# EasyEDA Pro project 模块化香薰灯电路原理图-初步dev001（嘉立创专业版）.epro

# Schematic 主板原理图
Board Name: 主板; Create Date: 2024-08-11; Page Name: P1; Project Name: 香薰灯0811; Schematic Name: 主板原理图; Update Date: 2024-08-12; Company: 嘉立创EDA; Page Size: A4; Version: V1.0
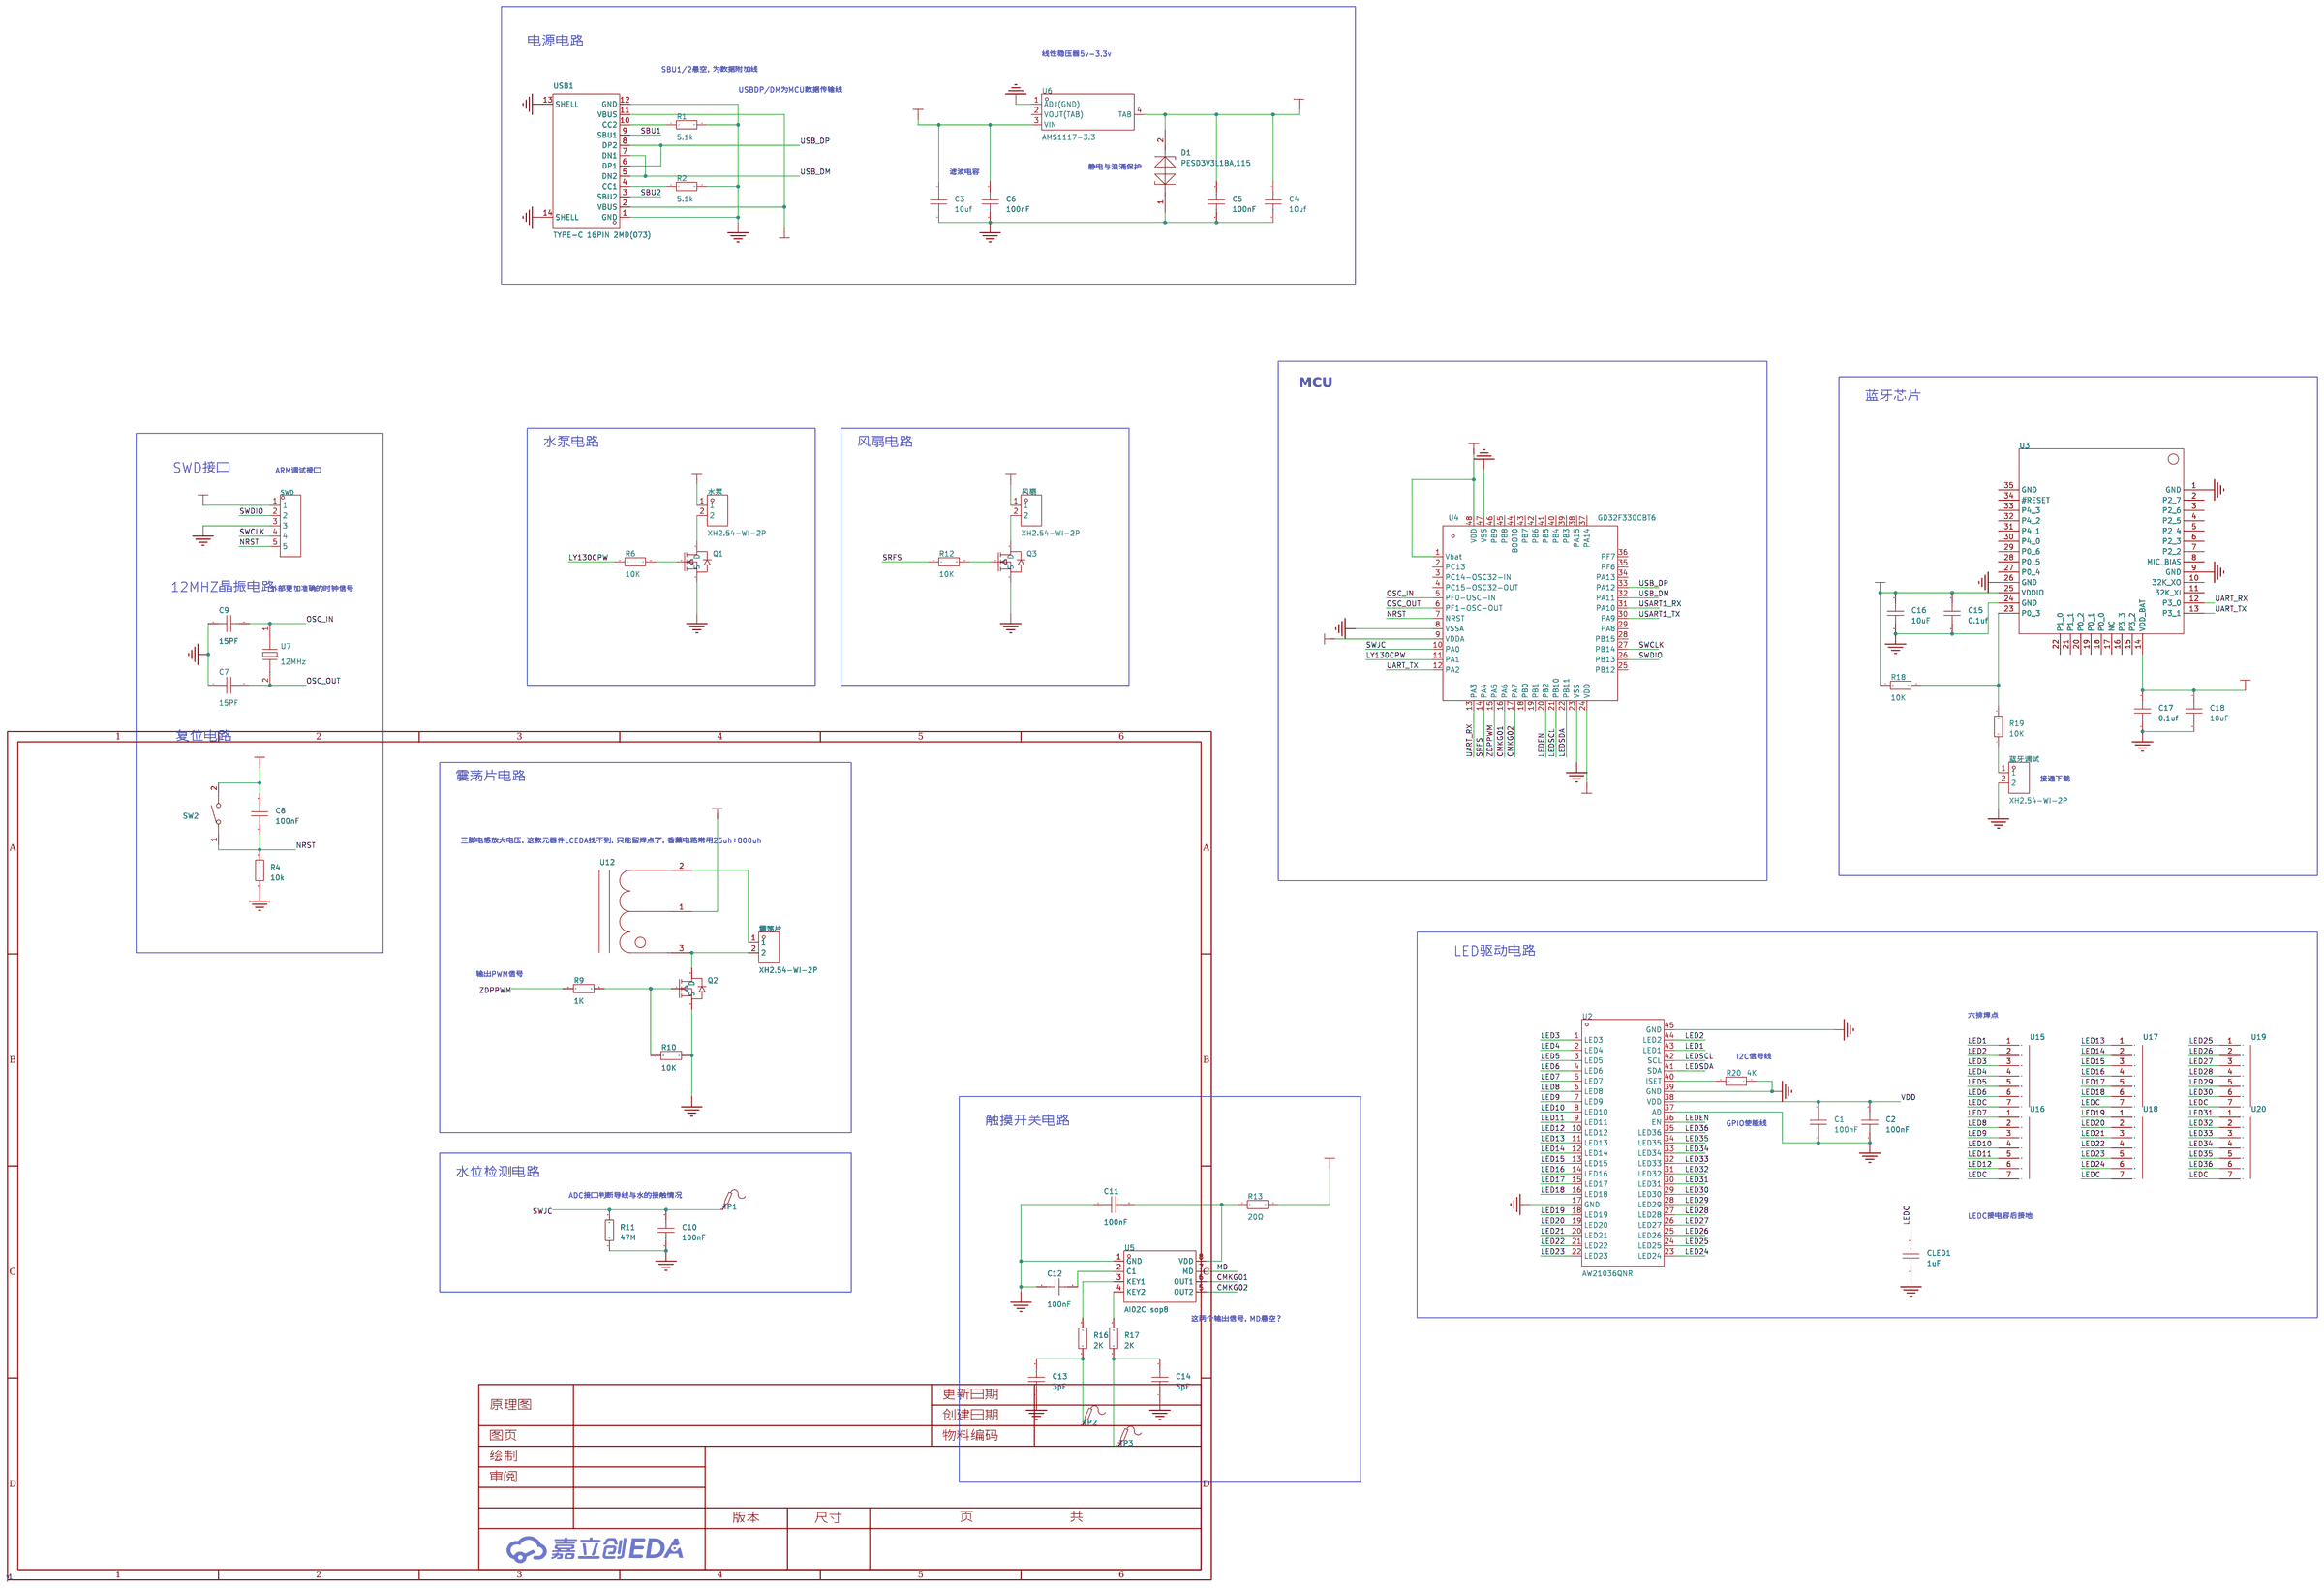
[diagram p0: schematic sheet]

## Parts
C1  100nF  [C0805]
C2  100nF  [C0805]
C3  10uf  [C0805]
C4  10uf  [C0805]
C5  100nF  [C0805]
C6  100nF  [C0805]
C7  15PF  [C0805]
C8  100nF  [C0805]
C9  15PF  [C0805]
C10  100nF  [C0805]
C11  100nF  [C0805]
C12  100nF  [C0805]
C13  3pF  [C0805]
C14  3pF  [C0805]
C15  0.1uf  [C0805]
C16  10uF  [C0805]
C17  0.1uf  [C0805]
C18  10uF  [C0805]
CLED1  1uF  [C0805]
D1  PESD3V3L1BA,115  [SOD-323_L1.8-W1.3-LS2.5-BI]
Q1  -  [SOT-23-3_L2.9-W1.3-P1.90-LS2.4-BR]
Q2  -  [SOT-23-3_L2.9-W1.3-P1.90-LS2.4-BR]
Q3  -  [SOT-23-3_L2.9-W1.3-P1.90-LS2.4-BR]
R1  5.1k  [R0805]
R2  5.1k  [R0805]
R4  10k  [R0805]
R6  10K  [R0805]
R9  1K  [R0805]
R10  10K  [R0805]
R11  47M  [R0805]
R12  10K  [R0805]
R13  20Ω  [R0805]
R16  2K  [R0805]
R17  2K  [R0805]
R18  10K  [R0805]
R19  10K  [R0805]
R20  4K  [R0805]
SW2  轻触按键3*4*H  [SW-SMD_L4.0-W2.9-LS5.0]
SWD  -  [HDR-TH_5P-P2.54-V-M]
TP1  -  [Test-Point-0.5mm]
TP2  -  [Test-Point-0.5mm]
TP3  -  [Test-Point-0.5mm]
U2  AW21036QNR  [QFN-44_L5.0-W5.0-P0.40-TL-EP2.5]
U3  -  [MHCB12G-IB]
U4  GD32F330CBT6  [LQFP-48_L7.0-W7.0-P0.50-LS9.0-BL]
U5  AI02C sop8  [SOP-8_L4.9-W3.9-P1.27-LS6.0-BL]
U6  AMS1117-3.3  [SOT-223-4_L6.5-W3.5-P2.30-LS7.0-BR]
U7  12MHz  [HC-49S_L11.0-W4.7-LS4.88]
U12  -  [CD75/CD0805]
U15  -  [12handian]
U16  -  [12handian]
U17  -  [12handian]
U18  -  [12handian]
U19  -  [12handian]
U20  -  [12handian]
USB1  TYPE-C 16PIN 2MD(073)  [USB-C-SMD_TYPE-C-6PIN-2MD-073]
水泵  XH2.54-WI-2P  [CONN-TH_XH2.54-WI-2P]
蓝牙调试  XH2.54-WI-2P  [CONN-TH_XH2.54-WI-2P]
震荡片  XH2.54-WI-2P  [CONN-TH_XH2.54-WI-2P]
风扇  XH2.54-WI-2P  [CONN-TH_XH2.54-WI-2P]

## Library data of the parts
C1-C18 CLED1 = CAP_0805: Supplier Footprint: 0805
D1 = PESD3V3L1BA,115: 极性:双向;反向截止电压(Vrwm):3.3V;最大钳位电压:26V;峰值脉冲电流(Ipp)@10/1000us:18A;峰值脉冲功率(Ppp)@10/1000us:500W;击穿电压:5.8V;; LCSC Part Name: 双向ESD; Supplier Part: C51450; Manufacturer: Nexperia(安世); Supplier Footprint: SOD-323; JLCPCB Part Class: 扩展库; Datasheet: https://atta.szlcsc.com/upload/public/pdf/source/20150618/1457707322983.pdf; Supplier: LCSC; polarity: 双向; Reverse Stand-Off Voltage (Vrwm): 3.3V; Maximum Clamping Voltage: 26V; Peak Pulse Current (Ipp)@10/1000us: 18A; Peak Pulse Power Dissipation (Ppp)@10/1000us: 500W; Breakdown Voltage: 5.8V; Operating Temperature: -65℃~+150℃@(Ta); Type: ESD
Q1-Q3 = AO3400A_N: 类型:N沟道;漏源电压(Vdss):30V;连续漏极电流(Id):5.2A;功率(Pd):1W;导通电阻(RDS(on)@Vgs,Id):35mΩ@10V,5A;阈值电压(Vgs(th)@Id):1.5V@250μA;; Supplier Footprint: SOT-23; Supplier Part: C700953
R1 R2 R4 R6 R9-R13 R16-R20 = Res_0805: Supplier Footprint: 0805
SW2 = 轻触按键3*4*H: Supplier Part: C9900017573; Supplier Footprint: 轻触按键3*4*2.5; Supplier: LCSC
SWD = HDR-M_2.54_1x5P: Supplier Part: C358687; Supplier Footprint: 插件
TP1-TP3 = Test-Point: Test Point 测试点
U2 = AW21036QNR: Supplier Part: C5125743; Manufacturer: AWINIC(艾为); Supplier Footprint: QFN-44-EP(5x5); JLCPCB Part Class: 扩展库; Datasheet: https://atta.szlcsc.com/upload/public/pdf/source/20220913/6ED7A783A0635C15F3BB01B459993D88.pdf; Supplier: LCSC
U3 = MHCB12G-B: 小米蓝牙芯片
U4 = GD32F330CBT6: CPU内核:CM4;程序存储容量:64KB;RAM总容量:16KB;GPIO端口数量:39;工作电压范围:2.6V~3.6V;CPU最大主频:84MHz;程序存储器类型:FLASH;; Supplier Part: C139946; Manufacturer: GigaDevice(兆易创新); Supplier Footprint: LQFP-48(7x7); JLCPCB Part Class: 扩展库; Datasheet: https://atta.szlcsc.com/upload/public/pdf/source/20180227/C182133_15196977406091370141.pdf; Supplier: LCSC; CPU Core: CM4; Program Storage Size: 64KB; RAM Size: 16KB; GPIO Ports Number: 39; Operating Voltage Range: 2.6V~3.6V; CPU Maximum Speed: 84MHz; Program Memory Type: FLASH; Operating Temperature Range: -40℃~+85℃; ADC (Bit): 12bit; PWM (Bit): 16bit; 16Bit Timer: 5; 32Bit Timer: 1; UART/USART: 2; I2C: 2; SPI: 2; Peripheral/Function: 片载温度传感器；DMA；看门狗；LIN总线协议；PWM；除法器；IrDA；乘法器；RTC实时时钟; Watchdog: 有; Real-Time Clock: 有; Infrared Data Association: 有; Direct Memory Access: 有; Internal Oscillator: 有
U5 = AI02C sop8: 通道数:2;; LCSC Part Name: 2通道触摸芯片; Supplier Part: C2943976; Manufacturer: Sam&wing(芯网); Supplier Footprint: SOP-8; JLCPCB Part Class: 扩展库; Datasheet: https://atta.szlcsc.com/upload/public/pdf/source/20220117/73357AC887120FD4586041BC17440E55.pdf; Supplier: LCSC; The Channel Number: 2
U6 = AMS1117-3.3_C347222: 输出类型:固定;最大输入电压:12V;输出电压:3.3V;最大输出电流:1A;电源纹波抑制比(PSRR):60dB@(120Hz);输出极性:正极;; LCSC Part Name: 输出:3.3V 电流:1A 耐压:12V; Supplier Part: C347222; Manufacturer: UMW(友台半导体); Supplier Footprint: SOT-223; JLCPCB Part Class: 扩展库; Datasheet: https://atta.szlcsc.com/upload/public/pdf/source/20231109/155D79A26D9DB04352555A58D5969DC8.pdf; Supplier: LCSC; Output Type: 固定; Maximum Input Voltage: 12V; Output Voltage: 3.3V; MAX Output Current: 1A; Power Supply Rejection Ratio (PSRR): 60dB@(120Hz); Dropout Voltage: 1.3V@(1A); Output Polarity: 正极; Number of Outputs: 1
U7 = 9AC12000123060C3: 晶振类型:直插晶振;频率:12MHz;常温频差:±30ppm;外接负载电容:12pF;; LCSC Part Name: 12MHz ±30ppm 12pF; Supplier Part: C2715912; Manufacturer: JGHC(晶光华); Supplier Footprint: HC-49S; JLCPCB Part Class: 扩展库; Datasheet: https://atta.szlcsc.com/upload/public/pdf/source/20210330/C2715912_C1248AC65A6D6A629B561008BE58AE5C.pdf; Supplier: LCSC; Crystal Type: 直插晶振; Normal temperature Frequency Tolerance: ±30ppm; External load capacitor: 12pF; Equivalent Series Resistance (ESR): 60Ω; Operating Temperature: -40℃~+85℃
U12 = CD75/CD0805
U15-U20 = 12handian
USB1 = TYPE-C 16PIN 2MD(073): 连接器类型:Type-C;标准:-;公母:母;端口数量:1;触点数量:16P;安装方式:卧贴;额定电流 - 电源:5A;工作温度范围:-25℃~+85℃;; LCSC Part Name: Type-C 母 卧贴; Supplier Part: C2765186; Manufacturer: SHOU HAN(首韩); Supplier Footprint: SMD; JLCPCB Part Class: 扩展库; Datasheet: https://atta.szlcsc.com/upload/public/pdf/source/20211123/39B17C16241EAC15C5E277BDA434118E.pdf; Supplier: LCSC; Connector Type: Type-C; Gender: 母; Number of Ports: 1; Number of Contacts: 16P; Mounting Style: 卧贴; Current Rating - Power (Max): 5A; Operating Temperature Range: -25℃~+85℃
水泵 蓝牙调试 震荡片 风扇 = XH2.54-WI-2P: Supplier Part: C9900005527; Supplier Footprint: XH2.54MM-2P; JLCPCB Part Class: 扩展库; Supplier: LCSC

## Nets
3.3V: C4.1 C5.1 C8.2 C15.1 C16.1 C17.1 C18.1 D1.2 R13.2 R18.1 SW2.2 SWD.1 U3.14(VDD_BAT) U3.25(VDDIO) U4.1(Vbat) U4.9(VDDA) U4.24(VDD) U4.48(VDD) U6.4(TAB) 水泵.1 风扇.1
GND: C1.1 C2.1 C3.2 C4.2 C5.2 C6.2 C7.1 C9.1 C10.2 C11.1 C12.1 C13.1 C14.1 C15.2 C16.2 C17.2 C18.2 CLED1.1 D1.1 Q1.2(S) Q2.2(S) Q3.2(S) R1.2 R2.2 R4.1 R10.2 R11.1 R20.1 SWD.3 U2.17(GND) U2.37(AD) U2.39(GND) U2.45(GND) U3.1(GND) U3.9(GND) U3.24(GND) U3.26(GND) U4.8(VSSA) U4.23(VSS) U4.47(VSS) U5.1(GND) U6.1(ADJ(GND)) USB1.1(GND) USB1.12(GND) USB1.13(SHELL) USB1.14(SHELL) 蓝牙调试.2
VDD: C1.2 C2.2 U2.38(VDD)
VIN: C3.1 C6.1 U6.3(VIN) U12.1 USB1.2(VBUS) USB1.11(VBUS)
CMKG01: U4.16(PA6) U5.6(OUT1)
CMKG02: U4.17(PA7) U5.5(OUT2)
LED1: U2.43(LED1) U15.1
LED2: U2.44(LED2) U15.2
LED3: U2.1(LED3) U15.3
LED4: U2.2(LED4) U15.4
LED5: U2.3(LED5) U15.5
LED6: U2.4(LED6) U15.6
LED7: U2.5(LED7) U16.1
LED8: U2.6(LED8) U16.2
LED9: U2.7(LED9) U16.3
LED10: U2.8(LED10) U16.4
LED11: U2.9(LED11) U16.5
LED12: U2.10(LED12) U16.6
LED13: U2.11(LED13) U17.1
LED14: U2.12(LED14) U17.2
LED15: U2.13(LED15) U17.3
LED16: U2.14(LED16) U17.4
LED17: U2.15(LED17) U17.5
LED18: U2.16(LED18) U17.6
LED19: U2.18(LED19) U18.1
LED20: U2.19(LED20) U18.2
LED21: U2.20(LED21) U18.3
LED22: U2.21(LED22) U18.4
LED23: U2.22(LED23) U18.5
LED24: U2.23(LED24) U18.6
LED25: U2.24(LED25) U19.1
LED26: U2.25(LED26) U19.2
LED27: U2.26(LED27) U19.3
LED28: U2.27(LED28) U19.4
LED29: U2.28(LED29) U19.5
LED30: U2.29(LED30) U19.6
LED31: U2.30(LED31) U20.1
LED32: U2.31(LED32) U20.2
LED33: U2.32(LED33) U20.3
LED34: U2.33(LED34) U20.4
LED35: U2.34(LED35) U20.5
LED36: U2.35(LED36) U20.6
LEDC: CLED1.2 U15.7 U16.7 U17.7 U18.7 U19.7 U20.7
LEDEN: U2.36(EN) U4.20(PB2)
LEDSCL: U2.42(SCL) U4.21(PB10)
LEDSDA: U2.41(SDA) U4.22(PB11)
LY130CPW: R6.1 U4.11(PA1)
MD: U5.7(MD)
NRST: C8.1 R4.2 SW2.1 SWD.5 U4.7(NRST)
OSC_IN: C9.2 U4.5(PF0-OSC-IN) U7.1
OSC_OUT: C7.2 U4.6(PF1-OSC-OUT) U7.2(GND)
SBU1: USB1.9(SBU1)
SBU2: USB1.3(SBU2)
SRFS: R12.1 U4.14(PA4)
SWCLK: SWD.4 U4.27(PB14)
SWDIO: SWD.2 U4.26(PB13)
SWJC: C10.1 R11.2 TP1.1 U4.10(PA0)
UART_RX: U3.12(P3_0) U4.13(PA3)
UART_TX: U3.13(P3_1) U4.12(PA2)
USART1_RX: U4.31(PA10)
USART1_TX: U4.30(PA9)
USB_DM: U4.32(PA11) USB1.5(DN2) USB1.7(DN1)
USB_DP: U4.33(PA12) USB1.6(DP1) USB1.8(DP2)
ZDPPWM: R9.1 U4.15(PA5)
$1N5125: R1.1 USB1.10(CC2)
$1N5189: R2.1 USB1.4(CC1)
$1N6579: Q1.3(D) 水泵.2
$1N6600: Q1.1(G) R6.2
$1N7931: Q2.1(G) R9.2 R10.1
$1N8080: Q2.3(D) U12.3 震荡片.2
$1N8094: U12.2 震荡片.1
$1N8507: Q3.1(G) R12.2
$1N8508: Q3.3(D) 风扇.2
$1N8591: C11.2 R13.1 U5.8(VDD)
$1N8758: C12.2 U5.2(C1)
$1N8776: R16.2 U5.3(KEY1)
$1N8784: R17.2 U5.4(KEY2)
$1N8987: C14.2 R17.1 TP3.1
$1N8992: C13.2 R16.1 TP2.1
$1N9527: R19.1 蓝牙调试.1
$1N9532: R18.2 R19.2 U3.23(P0_3)
$1N9686: R20.2 U2.40(ISET)

Not connected (* = marked no-connect by the designer): U3 2(P2_7) 3(P2_6) 4(P2_5) 5(P2_4) 6(P2_3) 7(P2_2) 8(MIC_BIAS) 10(32K_XO) 11(32K_XI) 15(P3_2) 16(P3_3) 17(NC) 18(P0_0) 19(P0_1) 20(P0_2) 21(P1_1) 22(P1_0) 27(P0_4) 28(P0_5) 29(P0_6) 30(P4_0) 31(P4_1) 32(P4_2) 33(P4_3) 34(#RESET) 35(GND); U4 2(PC13) 3(PC14-OSC32-IN) 4(PC15-OSC32-OUT) 18(PB0) 19(PB1) 25(PB12) 28(PB15) 29(PA8) 34(PA13) 35(PF6) 36(PF7) 37(PA14) 38(PA15) 39(PB3) 40(PB4) 41(PB5) 42(PB6) 43(PB7) 44(BOOT0) 45(PB8) 46(PB9); U6 2(VOUT(TAB))

## Notes on the sheet
- 电源电路
- 线性稳压器5v-3.3v
- SBU1/2悬空，为数据附加线
- USBDP/DM为MCU数据传输线
- 滤波电容
- 静电与浪涌保护
- MCU
- 蓝牙芯片
- 水泵电路
- 风扇电路
- SWD接口
- ARM调试接口
- 12MHZ晶振电路
- 外部更加准确的时钟信号
- 复位电路
- 震荡片电路
- 接通下载
- 三脚电感放大电压，这款元器件LCEDA找不到，只能留焊点了，香薰电路常用25uh：800uh
- LED驱动电路
- 输出PWM信号
- 六排焊点
- I2C信号线
- 触摸开关电路
- GPIO使能线
- 水位检测电路
- ADC接口判断导线与水的接触情况
- LEDC接电容后接地
- 这两个输出信号，MD悬空？

# Schematic 灯板原理图
Board Name: 灯板; Create Date: 2024-08-11; Page Name: P1; Project Name: 香薰灯0811; Schematic Name: 灯板原理图; Update Date: 2024-08-12; Company: 嘉立创EDA; Page Size: A4; Version: V1.0
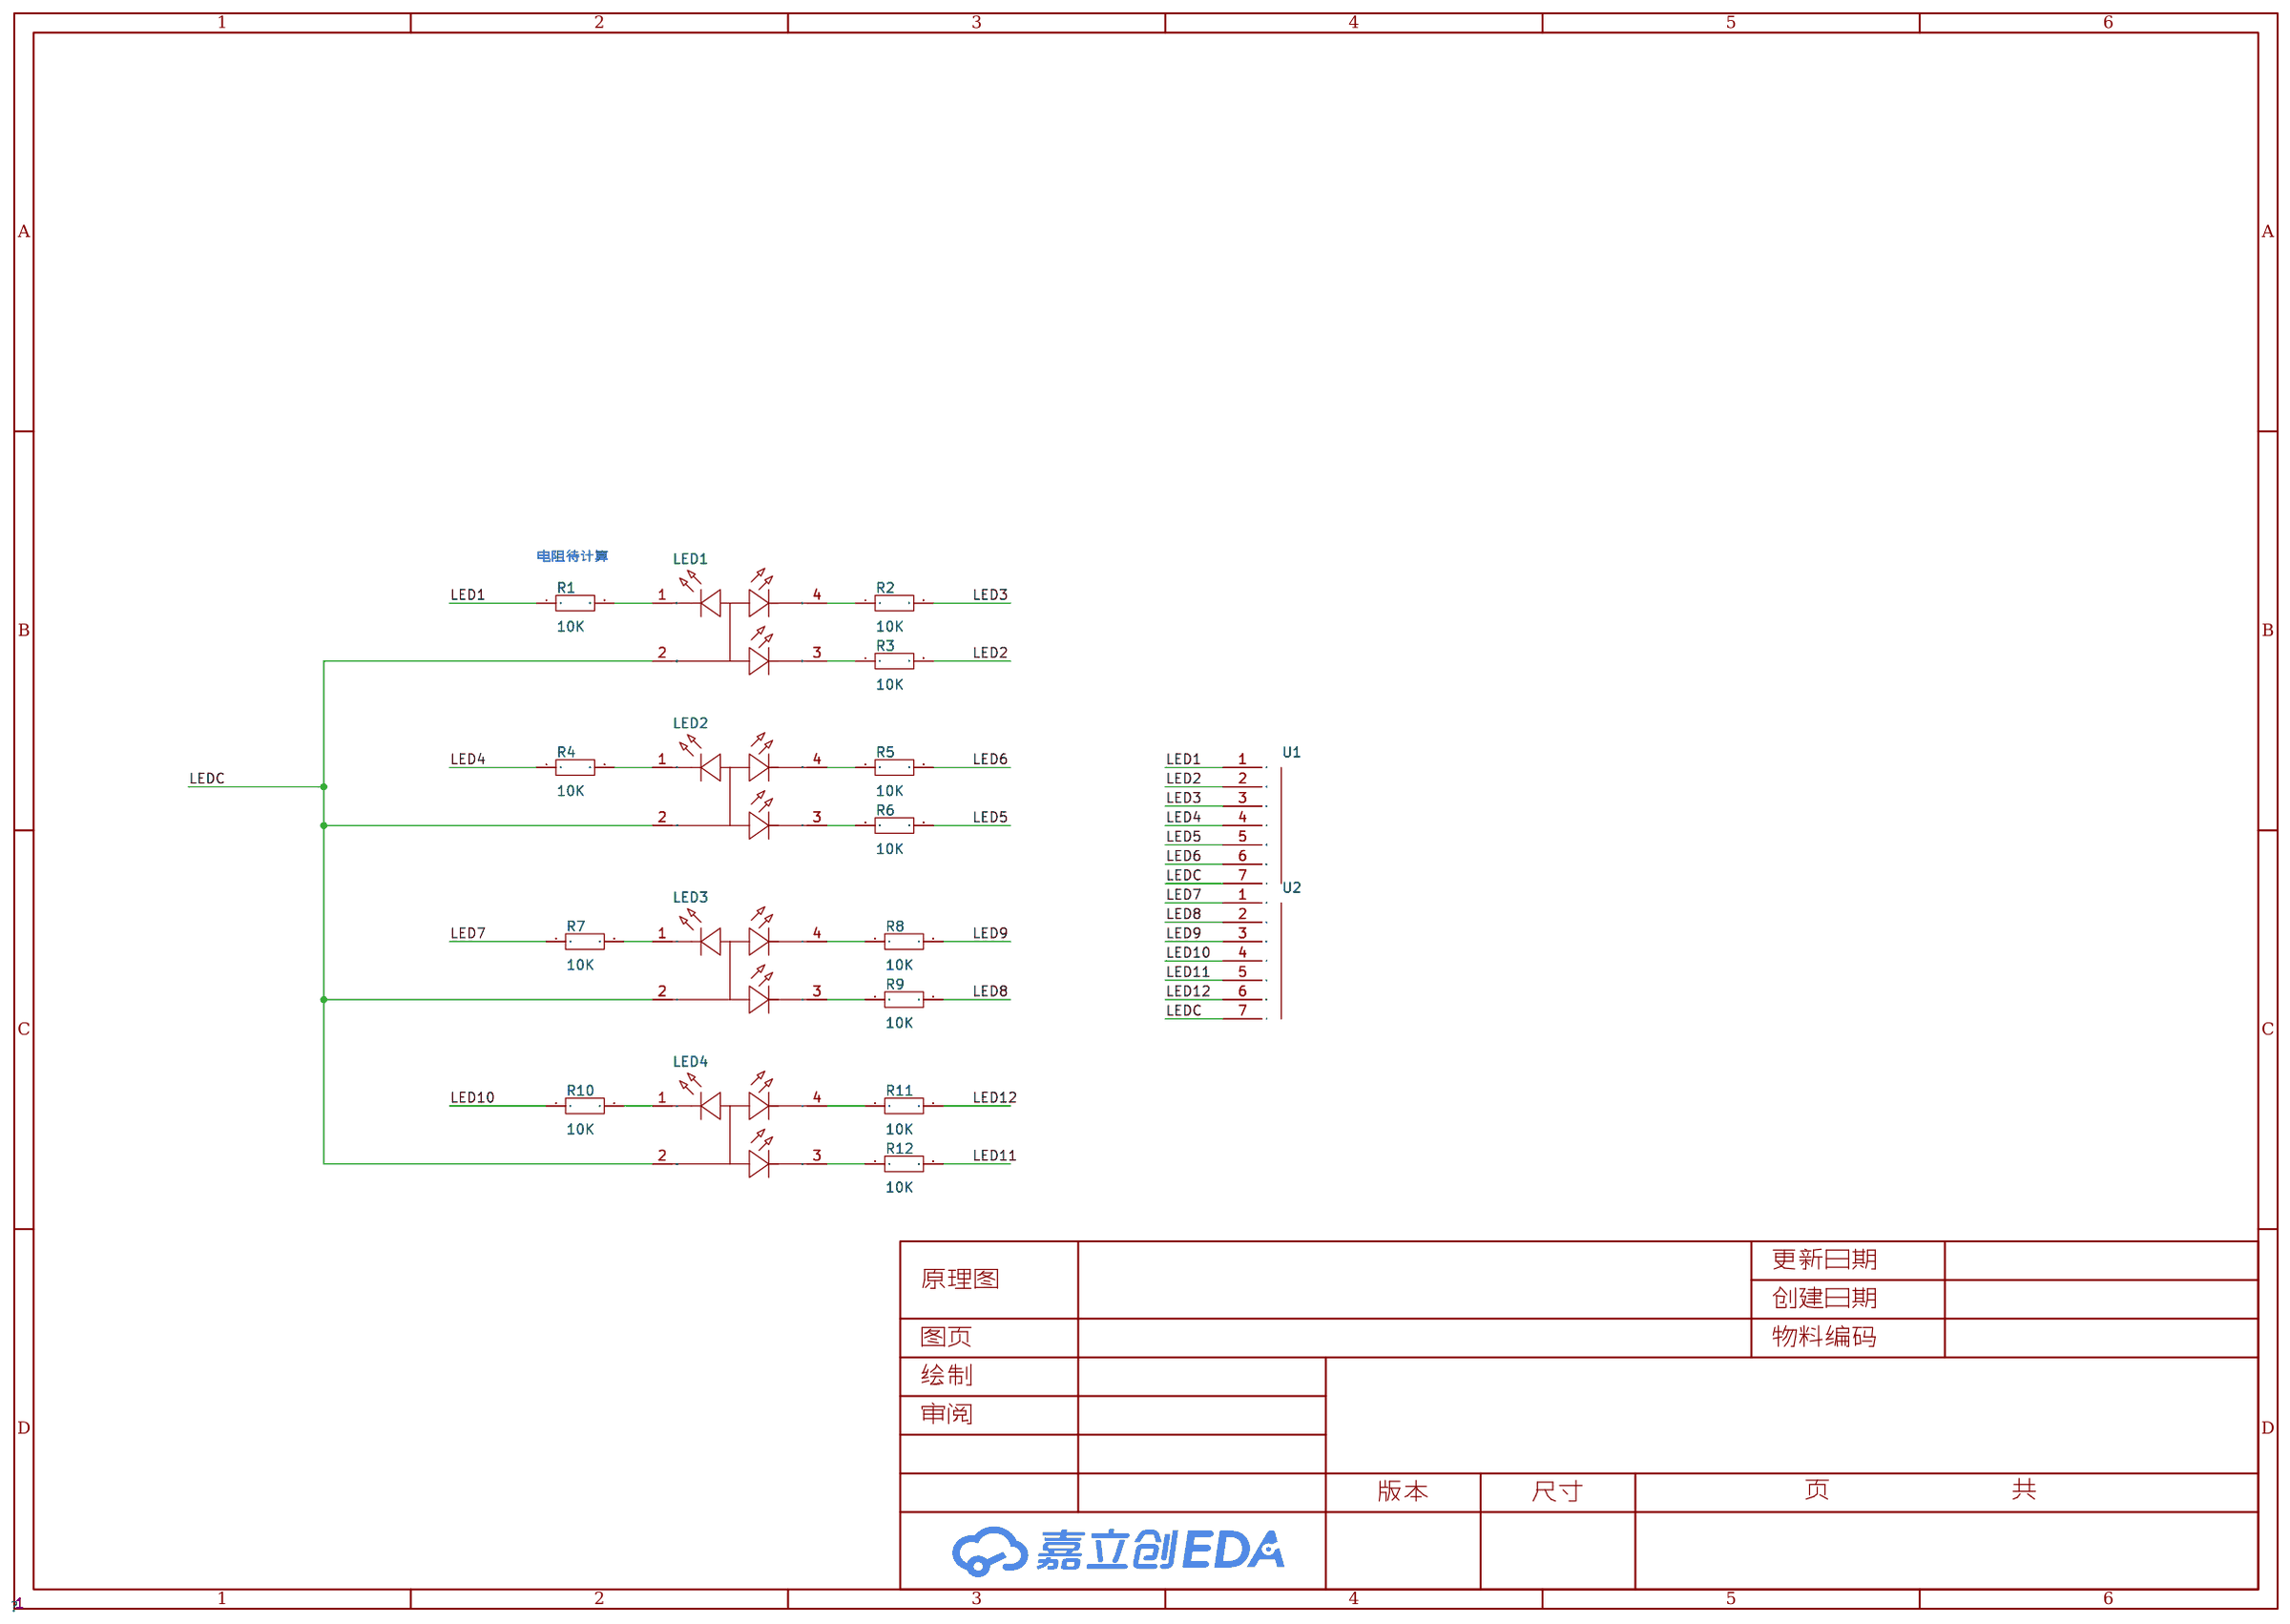
[diagram p1: schematic sheet]

## Parts
LED1  XL-1615RGBC-RF  [LED-ARRAY-SMD_4P-L1.6-W1.5-BR_XL-1615RGBC-RF]
LED2  XL-1615RGBC-RF  [LED-ARRAY-SMD_4P-L1.6-W1.5-BR_XL-1615RGBC-RF]
LED3  XL-1615RGBC-RF  [LED-ARRAY-SMD_4P-L1.6-W1.5-BR_XL-1615RGBC-RF]
LED4  XL-1615RGBC-RF  [LED-ARRAY-SMD_4P-L1.6-W1.5-BR_XL-1615RGBC-RF]
R1  10K  [R0805]
R2  10K  [R0805]
R3  10K  [R0805]
R4  10K  [R0805]
R5  10K  [R0805]
R6  10K  [R0805]
R7  10K  [R0805]
R8  10K  [R0805]
R9  10K  [R0805]
R10  10K  [R0805]
R11  10K  [R0805]
R12  10K  [R0805]
U1  -  [12handian]
U2  -  [12handian]

## Library data of the parts
LED1-LED4 = XL-1615RGBC-RF: Supplier Part: C965840; Manufacturer: XINGLIGHT(成兴光); Supplier Footprint: 0606; JLCPCB Part Class: 扩展库; Datasheet: https://atta.szlcsc.com/upload/public/pdf/source/20221102/F1B1FC7E45BA82C0C0D2B0679BEE9200.pdf; Supplier: LCSC
R1-R12 = Res_0805: Supplier Footprint: 0805
U1 U2 = 12handian

## Nets
LED1: R1.1 U1.1
LED2: R3.2 U1.2
LED3: R2.2 U1.3
LED4: R4.1 U1.4
LED5: R6.2 U1.5
LED6: R5.2 U1.6
LED7: R7.1 U2.1
LED8: R9.2 U2.2
LED9: R8.2 U2.3
LED10: R10.1 U2.4
LED11: R12.2 U2.5
LED12: R11.2 U2.6
LEDC: LED1.2(COM+) LED2.2(COM+) LED3.2(COM+) LED4.2(COM+) U1.7 U2.7
$1N1578: LED4.3(B-) R12.1
$1N1583: LED4.4(G-) R11.1
$1N1615: LED3.3(B-) R9.1
$1N1623: LED3.4(G-) R8.1
$1N1625: LED4.1(R-) R10.2
$1N1643: LED3.1(R-) R7.2
$1N1663: LED2.3(B-) R6.1
$1N1668: LED2.4(G-) R5.1
$1N1673: LED2.1(R-) R4.2
$1N1675: LED1.3(B-) R3.1
$1N1683: LED1.4(G-) R2.1
$1N1688: LED1.1(R-) R1.2

## Notes on the sheet
- 电阻待计算

# Board 主板PCB
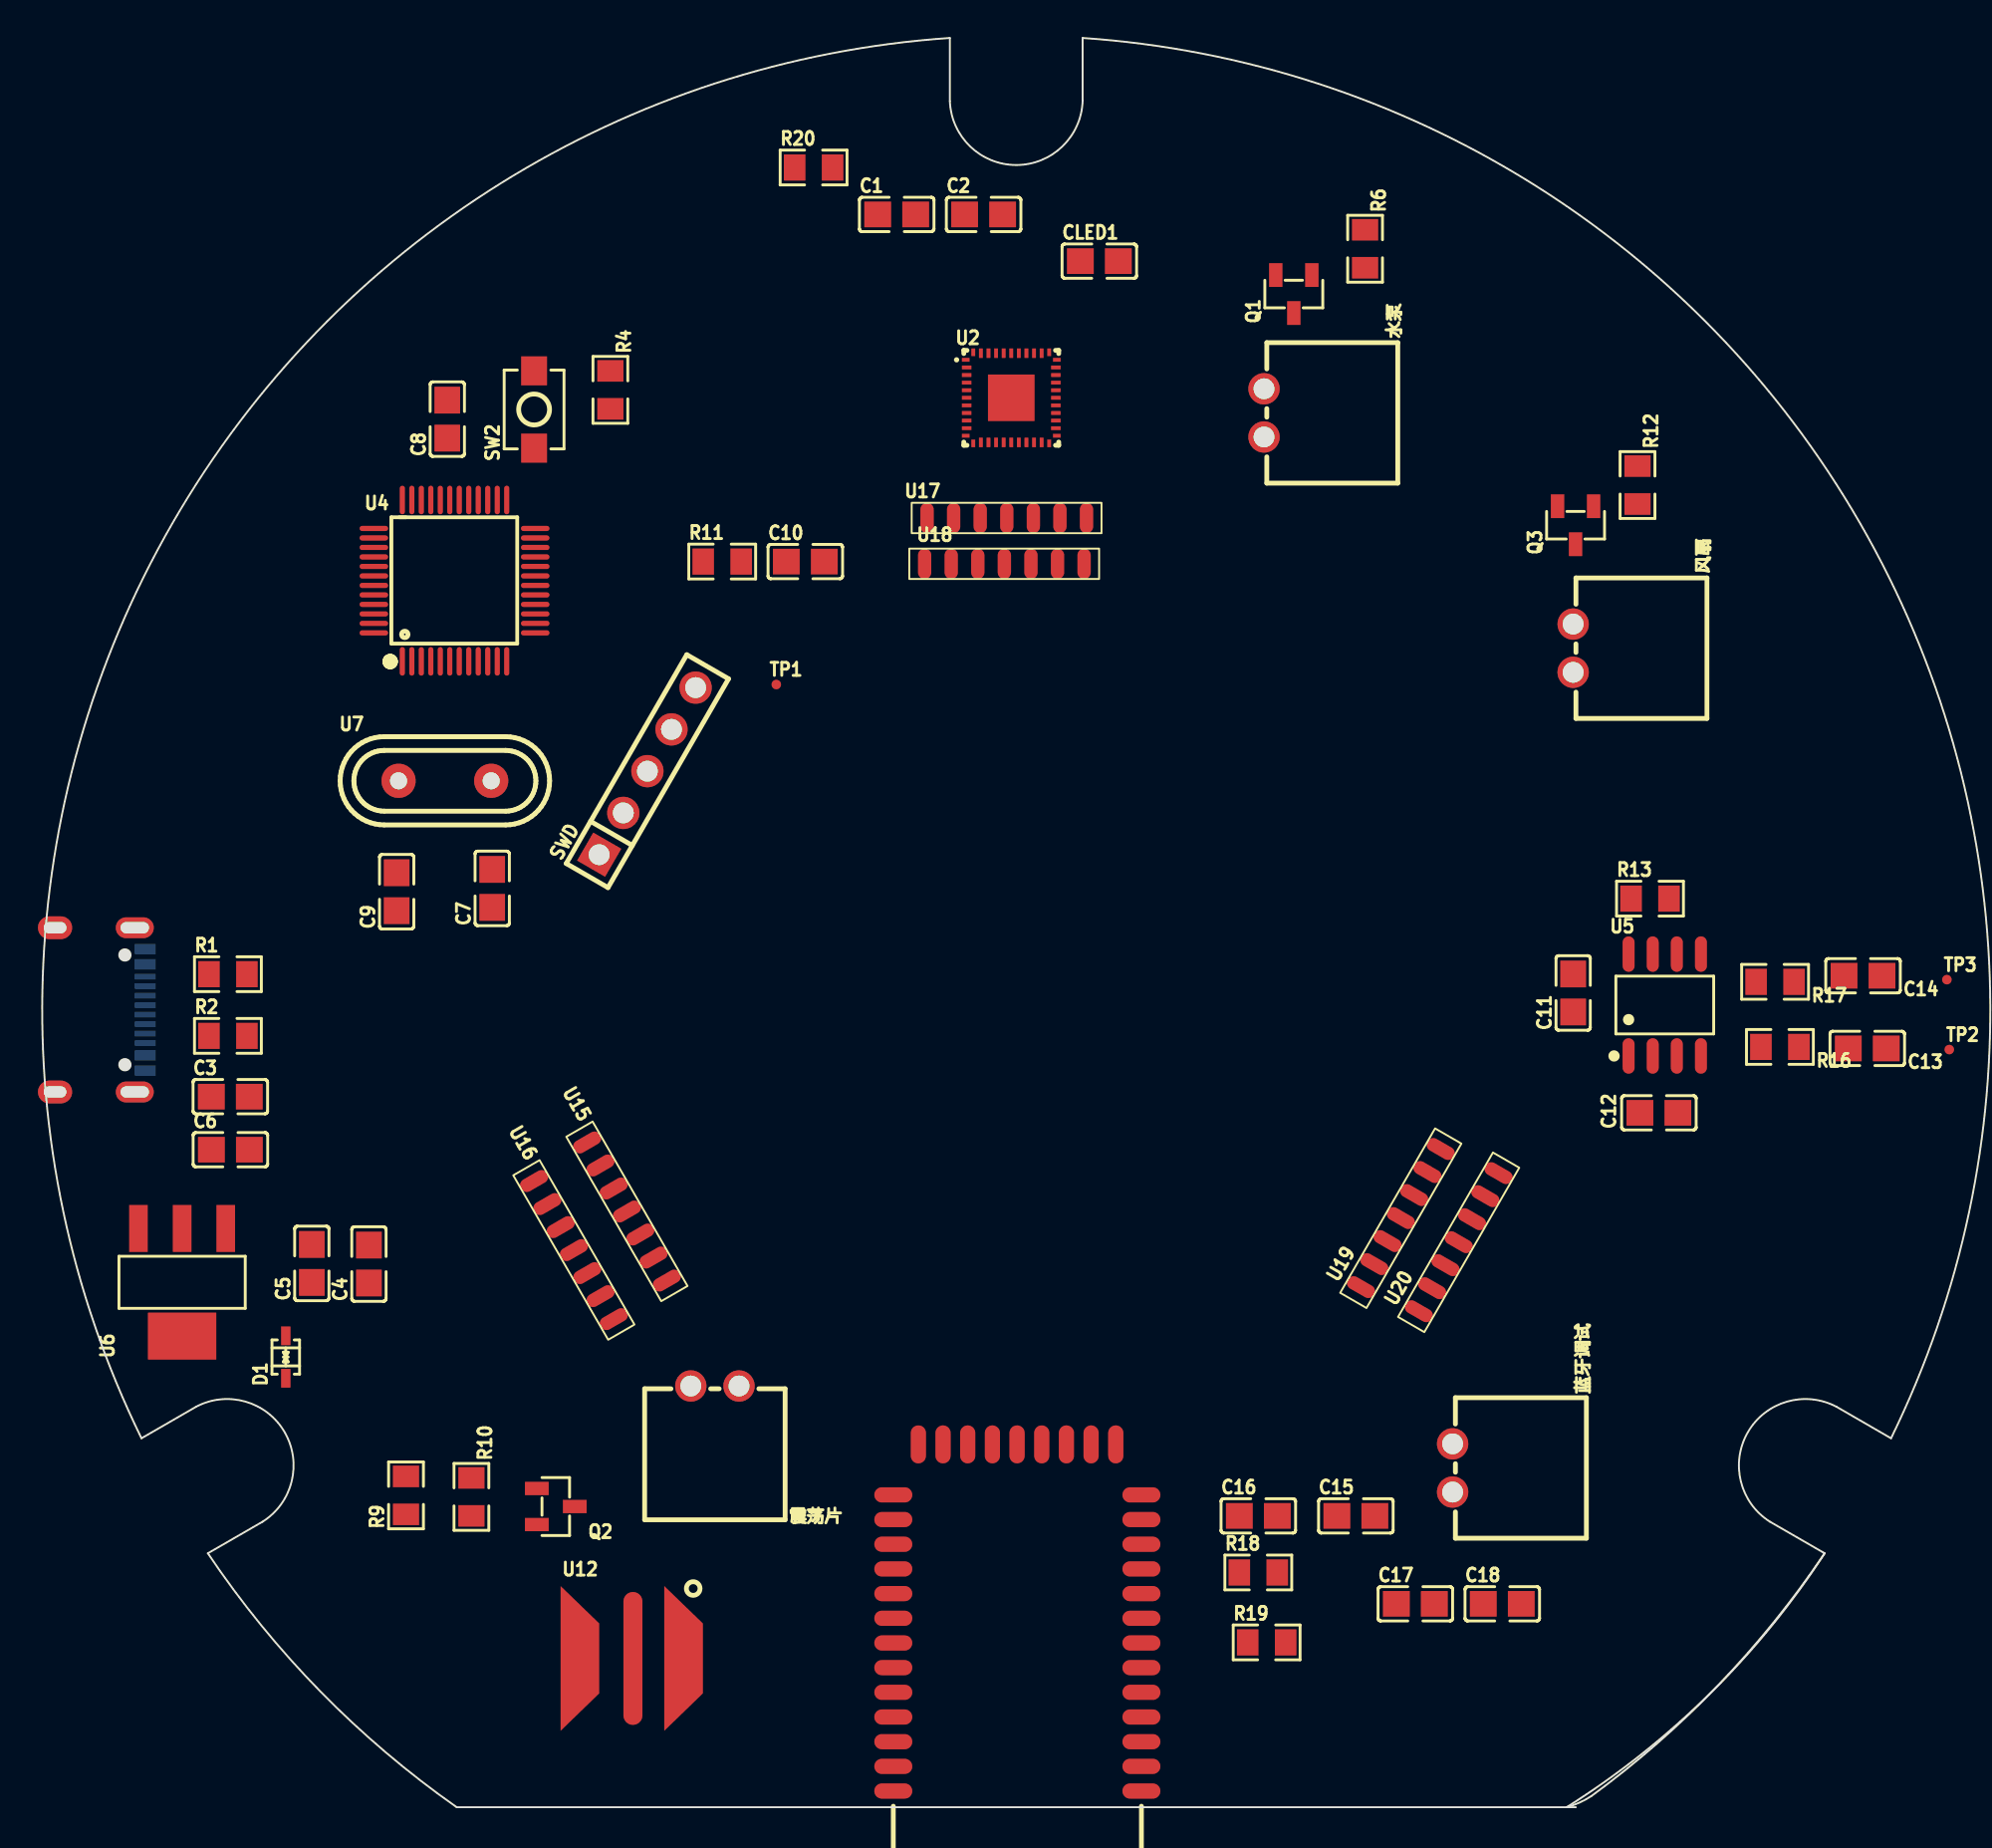
[diagram p2: board, top side]
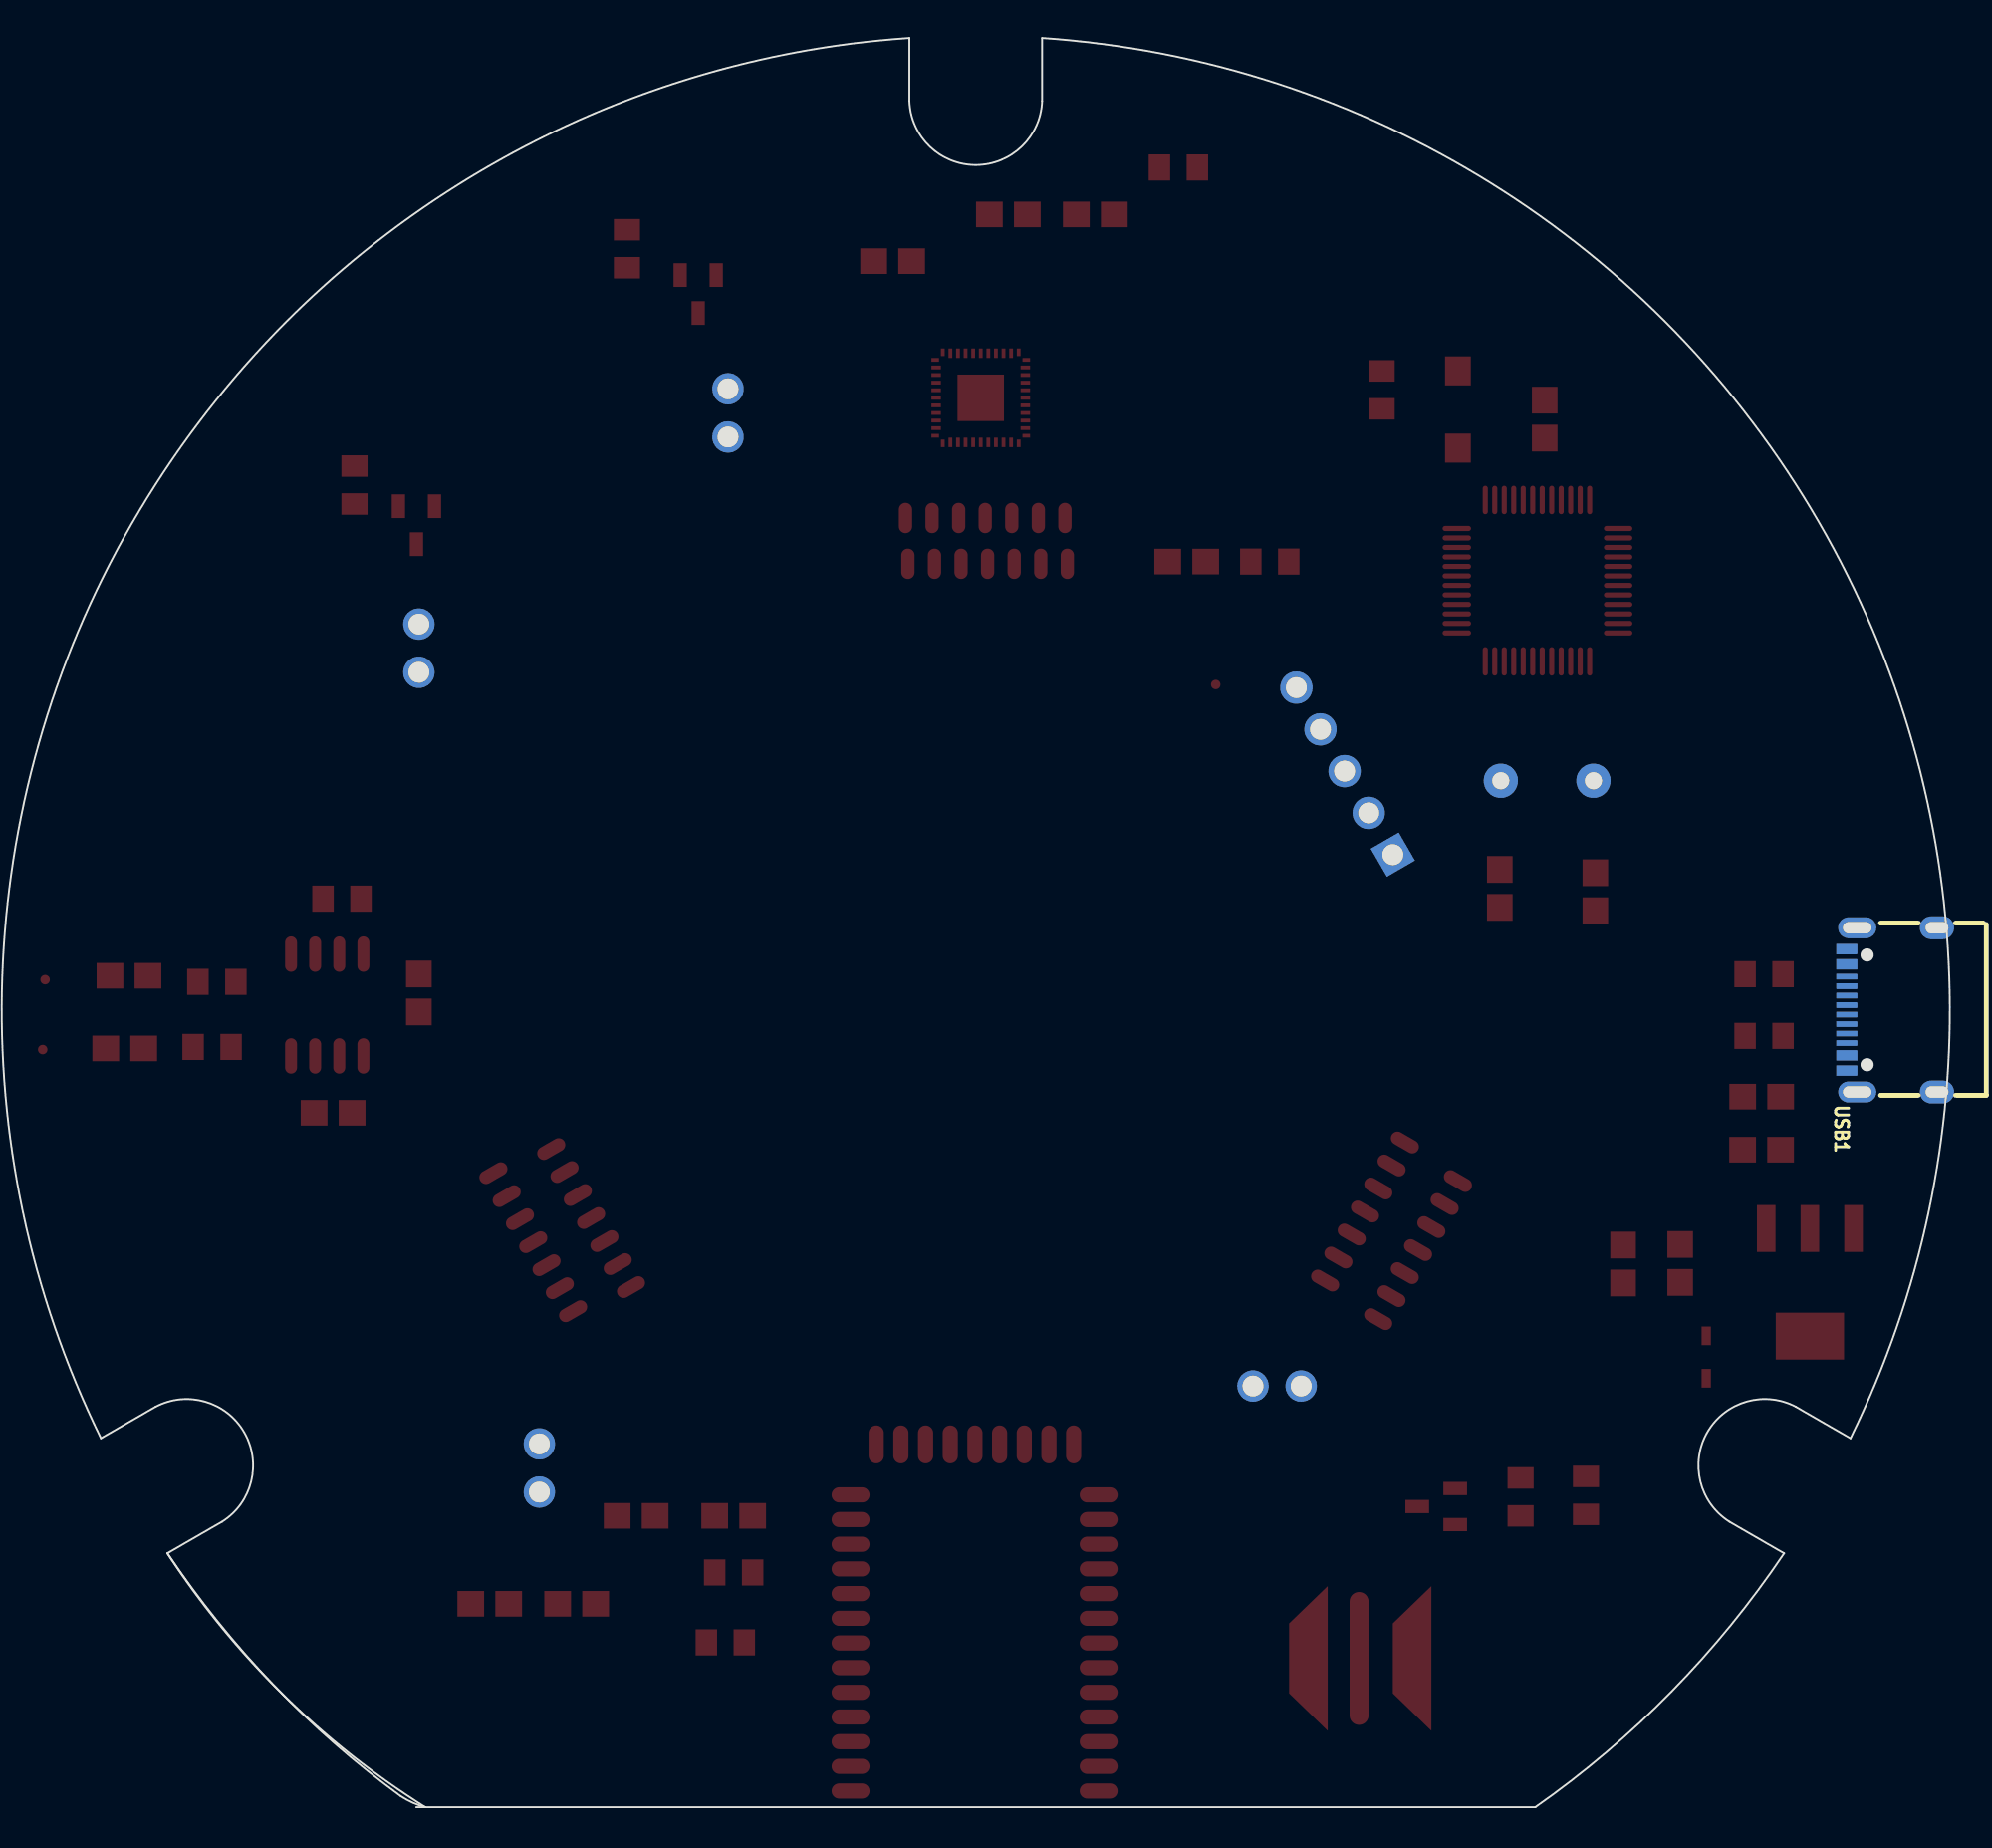
[diagram p3: board, bottom side, seen from below]

Outline 102.62 x 93.19 mm; copper layers: Top Layer, Bottom Layer. Coordinates in mm from the lower left corner of the outline.
Outline path: 80.79,0 21.84,0 arc(14.67,6.08) 8.73,13.38 11.6,15.03 arc(12.77,19.75) 8.1,21.09 5.23,19.43 arc(6.88,67.66) 47.81,93.19 47.81,89.87 arc(51.31,86.5) 54.81,89.87 54.81,93.19 arc(95.75,67.66) 97.39,19.43 94.52,21.09 arc(89.85,19.75) 91.02,15.03 93.9,13.38 ; 93.9,13.38 arc(87.96,6.08) 80.31,0 arc(80.76,0.15) 81.6,0.58 arc(88.3,6.44) 93.9,13.38
Stack: Top Layer 0.035mm / Dielectric1 1.51mm FR4 er 4.5 / Bottom Layer 0.035mm

## Design rules (mm)
template: JLCPCB Capability(Two Layers Board)
spacing copperThickness1oz (default): track to track 0.102, other pairs 0.152 to 0.3
spacing copperThickness2oz: track to track 0.203, other pairs 0.152 to 0.3
track width copperThickness1oz (default): min 0.127, default 0.254, max 2.54
track width copperThickness2oz: min 0.203, default 0.254, max 2.54
differential pair differentialPair (default): width min 0.127, default 0.254, max 2.54; gap min 0.152, default 0.152
via viaSize (default): diameter min 0.5, default 0.61, max 10; hole min 0.3, default 0.305, max 6.3

## Placement (name value [footprint] x y rotation side)
C1  100nF  [C0805]  45.01 83.9 0 top
C2  100nF  [C0805]  49.59 83.9 0 top
C3  10uf  [C0805]  9.91 37.43 0 top
C4  10uf  [C0805]  17.21 28.61 90 top
C5  100nF  [C0805]  14.2 28.64 90 top
C6  100nF  [C0805]  9.91 34.63 0 top
C7  15PF  [C0805]  23.71 48.4 90 top
C8  100nF  [C0805]  21.34 73.11 90 top
C9  15PF  [C0805]  18.67 48.22 90 top
C10  100nF  [C0805]  40.2 65.61 0 top
C11  100nF  [C0805]  80.65 42.89 90 top
C12  100nF  [C0805]  85.17 36.58 0 top
C13  3pF  [C0805]  96.14 39.97 180 top
C14  3pF  [C0805]  95.92 43.8 180 top
C15  0.1uf  [C0805]  69.2 15.35 0 top
C16  10uF  [C0805]  64.06 15.35 0 top
C17  0.1uf  [C0805]  72.34 10.71 0 top
C18  10uF  [C0805]  76.92 10.71 0 top
CLED1  1uF  [C0805]  55.69 81.44 0 top
D1  PESD3V3L1BA,115  [SOD-323_L1.8-W1.3-LS2.5-BI]  12.83 23.71 90 top
Q1  -  [SOT-23-3_L2.9-W1.3-P1.90-LS2.4-BR]  65.93 79.7 90 top
Q2  -  [SOT-23-3_L2.9-W1.3-P1.90-LS2.4-BR]  27.06 15.84 180 top
Q3  -  [SOT-23-3_L2.9-W1.3-P1.90-LS2.4-BR]  80.78 67.53 90 top
R1  5.1k  [R0805]  9.78 43.88 0 top
R2  5.1k  [R0805]  9.78 40.63 0 top
R4  10k  [R0805]  29.93 74.66 270 top
R6  10K  [R0805]  69.69 82.09 270 top
R9  1K  [R0805]  19.17 16.43 90 top
R10  10K  [R0805]  22.61 16.35 270 top
R11  47M  [R0805]  35.82 65.61 0 top
R12  10K  [R0805]  84.04 69.64 270 top
R13  20Ω  [R0805]  84.7 47.86 0 top
R16  2K  [R0805]  91.54 40.05 180 top
R17  2K  [R0805]  91.29 43.48 180 top
R18  10K  [R0805]  64.06 12.37 0 top
R19  10K  [R0805]  64.5 8.68 0 top
R20  4K  [R0805]  40.64 86.37 0 top
SW2  轻触按键3*4*H  [SW-SMD_L4.0-W2.9-LS5.0]  25.91 73.62 90 top
SWD  -  [HDR-TH_5P-P2.54-V-M]  31.88 54.57 60 top
TP1  -  [Test-Point-0.5mm]  38.67 59.14 0 top
TP2  -  [Test-Point-0.5mm]  100.46 39.91 0 top
TP3  -  [Test-Point-0.5mm]  100.34 43.59 0 top
U2  AW21036QNR  [QFN-44_L5.0-W5.0-P0.40-TL-EP2.5]  51.05 74.24 0 top
U3  -  [MHCB12G-IB]  44.84 0.85 90 top
U4  GD32F330CBT6  [LQFP-48_L7.0-W7.0-P0.50-LS9.0-BL]  21.72 64.61 0 top
U5  AI02C sop8  [SOP-8_L4.9-W3.9-P1.27-LS6.0-BL]  85.48 42.25 0 top
U6  AMS1117-3.3  [SOT-223-4_L6.5-W3.5-P2.30-LS7.0-BR]  7.37 27.65 90 top
U7  12MHz  [HC-49S_L11.0-W4.7-LS4.88]  21.21 54.06 0 top
U12  -  [CD75/CD0805]  31.12 7.84 0 top
U15  -  [12handian]  28.71 35.02 300 top
U16  -  [12handian]  25.91 32.98 300 top
U17  -  [12handian]  46.61 67.91 0 top
U18  -  [12handian]  46.49 65.5 0 top
U19  -  [12handian]  69.47 27.39 60 top
U20  -  [12handian]  72.52 26.12 60 top
USB1  TYPE-C 16PIN 2MD(073)  [USB-C-SMD_TYPE-C-6PIN-2MD-073]  3.05 42 90 bottom
水泵  XH2.54-WI-2P  [CONN-TH_XH2.54-WI-2P]  64.36 73.44 270 top
蓝牙调试  XH2.54-WI-2P  [CONN-TH_XH2.54-WI-2P]  74.3 17.87 270 top
震荡片  XH2.54-WI-2P  [CONN-TH_XH2.54-WI-2P]  35.44 22.19 180 top
风扇  XH2.54-WI-2P  [CONN-TH_XH2.54-WI-2P]  80.65 61.05 270 top

## Footprints (pads in the part's own frame, mm; a bottom-side part is the same pattern mirrored in y, then rotated)
12handian
  oval 0.7x1.6 smd: 1(0,0) 2(1.4,0) 3(2.8,0) 4(4.2,0) 5(5.6,0) 6(7,0) 7(8.4,0)
C0805
  rect 1.41x1.35 smd: 1(-1,0) 2(1,0)
CD75/CD0805
  oval 1x7 smd: 1(0,0)
  custom 2.032x7.62 smd: 2(-2.794,0) 3(2.667,0)
CONN-TH_XH2.54-WI-2P
  round 1.65 hole 1.1: 1(-1.27,0) 2(1.27,0)
HC-49S_L11.0-W4.7-LS4.88
  round 1.8 hole 0.9: 1(-2.44,0) 2(2.44,0)
HDR-TH_5P-P2.54-V-M
  rect 1.7x1.7 hole 1.1: 1(-5.08,0)
  round 1.7 hole 1.1: 2(-2.54,0) 3(0,0) 4(2.54,0) 5(5.08,0)
LQFP-48_L7.0-W7.0-P0.50-LS9.0-BL
  oval 0.27x1.5 smd: 1(-2.75,-4.25) 2(-2.25,-4.25) 3(-1.75,-4.25) 4(-1.25,-4.25) 5(-0.75,-4.25) 6(-0.25,-4.25) 7(0.25,-4.25) 8(0.75,-4.25) 9(1.25,-4.25) 10(1.75,-4.25) 11(2.25,-4.25) 12(2.75,-4.25) 25(2.75,4.25) 26(2.25,4.25) 27(1.75,4.25) 28(1.25,4.25) 29(0.75,4.25) 30(0.25,4.25) 31(-0.25,4.25) 32(-0.75,4.25) 33(-1.25,4.25) 34(-1.75,4.25) 35(-2.25,4.25) 36(-2.75,4.25)
  oval 1.5x0.27 smd: 13(4.25,-2.75) 14(4.25,-2.25) 15(4.25,-1.75) 16(4.25,-1.25) 17(4.25,-0.75) 18(4.25,-0.25) 19(4.25,0.25) 20(4.25,0.75) 21(4.25,1.25) 22(4.25,1.75) 23(4.25,2.25) 24(4.25,2.75) 37(-4.25,2.75) 38(-4.25,2.25) 39(-4.25,1.75) 40(-4.25,1.25) 41(-4.25,0.75) 42(-4.25,0.25) 43(-4.25,-0.25) 44(-4.25,-0.75) 45(-4.25,-1.25) 46(-4.25,-1.75) 47(-4.25,-2.25) 48(-4.25,-2.75)
MHCB12G-IB
  oval 0.8x2 smd: 1(0,0) 2(1.3,0) 3(2.6,0) 4(3.9,0) 5(5.2,0) 6(6.5,0) 7(7.8,0) 8(9.1,0) 9(10.4,0) 10(11.7,0) 11(13,0) 12(14.3,0) 13(15.6,0) 23(15.6,-13.07) 24(14.3,-13.07) 25(13,-13.07) 26(11.7,-13.07) 27(10.4,-13.07) 28(9.1,-13.07) 29(7.8,-13.07) 30(6.5,-13.07) 31(5.2,-13.07) 32(3.9,-13.07) 33(2.6,-13.07) 34(1.3,-13.07) 35(0,-13.07)
  oval 2x0.8 smd: 14(18.26,-1.32) 15(18.26,-2.62) 16(18.26,-3.92) 17(18.26,-5.22) 18(18.26,-6.52) 19(18.26,-7.82) 20(18.26,-9.12) 21(18.26,-10.42) 22(18.26,-11.72)
QFN-44_L5.0-W5.0-P0.40-TL-EP2.5
  rect 0.4x0.2 smd: 1(-2.4,2) 11(-2.4,-2) 23(2.4,-2) 33(2.4,2)
  rect 0.5x0.2 smd: 2(-2.35,1.6) 3(-2.35,1.2) 4(-2.35,0.8) 5(-2.35,0.4) 6(-2.35,0) 7(-2.35,-0.4) 8(-2.35,-0.8) 9(-2.35,-1.2) 10(-2.35,-1.6) 24(2.35,-1.6) 25(2.35,-1.2) 26(2.35,-0.8) 27(2.35,-0.4) 28(2.35,0) 29(2.35,0.4) 30(2.35,0.8) 31(2.35,1.2) 32(2.35,1.6)
  rect 0.2x0.4 smd: 12(-2,-2.4) 22(2,-2.4) 34(2,2.4) 44(-2,2.4)
  rect 0.2x0.5 smd: 13(-1.6,-2.35) 14(-1.2,-2.35) 15(-0.8,-2.35) 16(-0.4,-2.35) 17(0,-2.35) 18(0.4,-2.35) 19(0.8,-2.35) 20(1.2,-2.35) 21(1.6,-2.35) 35(1.6,2.35) 36(1.2,2.35) 37(0.8,2.35) 38(0.4,2.35) 39(0,2.35) 40(-0.4,2.35) 41(-0.8,2.35) 42(-1.2,2.35) 43(-1.6,2.35)
  rect 2.45x2.45 smd: 45(0,0)
R0805
  rect 1.133x1.377 smd: 1(-1,0) 2(1,0)
SOD-323_L1.8-W1.3-LS2.5-BI
  rect 0.985x0.49 smd: 1(-1.117,0) 2(1.117,0)
SOP-8_L4.9-W3.9-P1.27-LS6.0-BL
  oval 0.63x1.865 smd: 1(-1.905,-2.683) 2(-0.635,-2.683) 3(0.635,-2.683) 4(1.905,-2.683) 5(1.905,2.683) 6(0.635,2.683) 7(-0.635,2.683) 8(-1.905,2.683)
SOT-23-3_L2.9-W1.3-P1.90-LS2.4-BR
  rect 1.25x0.7 smd: 1(1,-0.95) 2(1,0.95) 3(-1,0)
SOT-223-4_L6.5-W3.5-P2.30-LS7.0-BR
  rect 2.47x0.98 smd: 1(2.835,-2.3) 2(2.835,0) 3(2.835,2.3)
  rect 2.47x3.6 smd: 4(-2.835,0)
SW-SMD_L4.0-W2.9-LS5.0
  rect 1.53x1.36 smd: 1(-2.035,0) 2(2.035,0)
Test-Point-0.5mm
  round 0.5 smd: 1(0,0)
USB-C-SMD_TYPE-C-6PIN-2MD-073
  rect 0.55x1.1 smd: 1(-3.2,2.375) 2(-2.4,2.375) 11(2.4,2.375) 12(3.2,2.375)
  rect 0.3x1.1 smd: 3(-1.75,2.375) 4(-1.25,2.375) 5(-0.75,2.375) 6(-0.25,2.375) 7(0.25,2.375) 8(0.75,2.375) 9(1.25,2.375) 10(1.75,2.375)
  oval 1.2x1.8 hole 0.6x1.2: 13(-4.325,-2.375) 14(4.325,-2.375)
  oval 1.1x2 hole 0.6x1.5: 13(-4.325,1.825) 14(4.325,1.825)

## Nets
As in the schematic.

Pads without a net: U3 2 3 4 5 6 7 8 10 11 15 16 17 18 19 20 21 22 27 28 29 30 31 32 33 34 35; U4 2 3 4 18 19 25 28 29 34 35 36 37 38 39 40 41 42 43 44 45 46; U6 2

# Board 灯板PCB
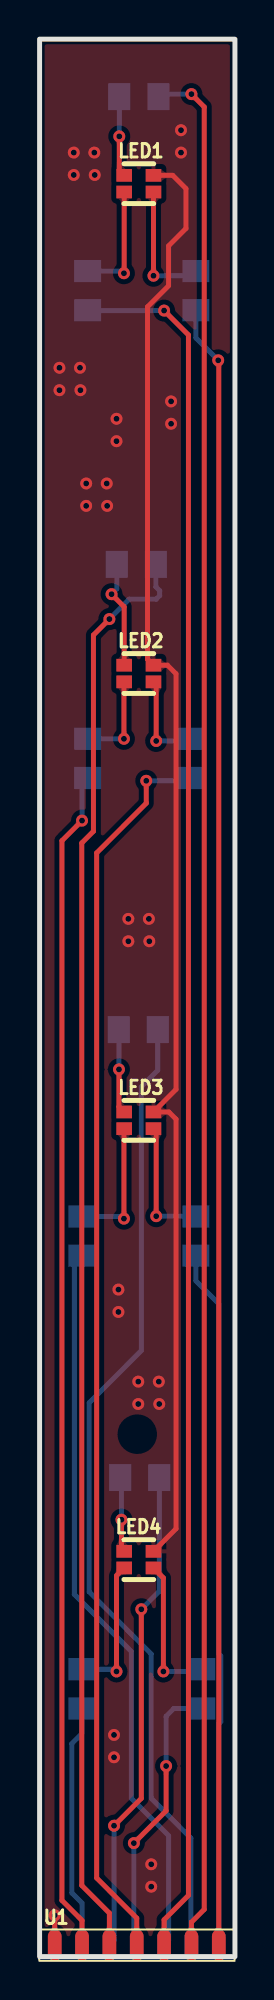
[diagram p4: board, top side]
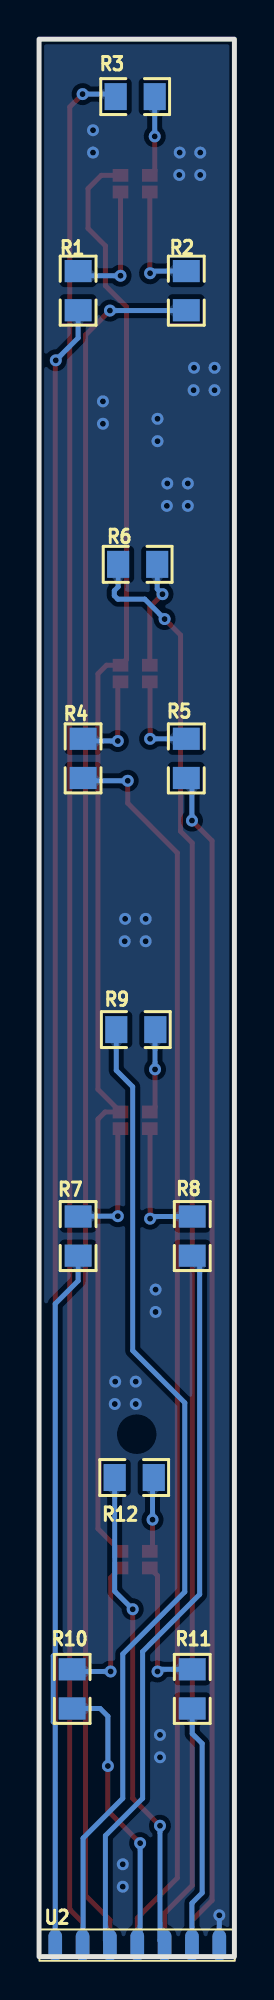
[diagram p5: board, bottom side, seen from below]

Outline 10 x 97.88 mm; copper layers: Top Layer, Bottom Layer. Coordinates in mm from the lower left corner of the outline.
Outline path: rectangle 0,97.88 10,0
Stack: Top Layer 0.035mm / Dielectric1 1.51mm FR4 er 4.5 / Bottom Layer 0.035mm

## Design rules (mm)
template: JLCPCB Capability(Two Layers Board)
spacing copperThickness1oz (default): track to track 0.102, other pairs 0.152 to 0.3
spacing copperThickness2oz: track to track 0.203, other pairs 0.152 to 0.3
track width copperThickness1oz (default): min 0.127, default 0.254, max 2.54
track width copperThickness2oz: min 0.203, default 0.254, max 2.54
differential pair differentialPair (default): width min 0.127, default 0.254, max 2.54; gap min 0.152, default 0.152
via viaSize (default): diameter min 0.5, default 0.61, max 10; hole min 0.3, default 0.305, max 6.3

## Placement (name value [footprint] x y rotation side)
LED1  XL-1615RGBC-RF  [LED-ARRAY-SMD_4P-L1.6-W1.5-BR_XL-1615RGBC-RF]  5.08 90.5 0 top
LED2  XL-1615RGBC-RF  [LED-ARRAY-SMD_4P-L1.6-W1.5-BR_XL-1615RGBC-RF]  5.08 65.5 0 top
LED3  XL-1615RGBC-RF  [LED-ARRAY-SMD_4P-L1.6-W1.5-BR_XL-1615RGBC-RF]  5.08 42.69 0 top
LED4  XL-1615RGBC-RF  [LED-ARRAY-SMD_4P-L1.6-W1.5-BR_XL-1615RGBC-RF]  5.08 20.27 0 top
R1  10K  [R0805]  8 85.04 90 bottom
R2  10K  [R0805]  2.46 85.04 270 bottom
R3  10K  [R0805]  5.08 94.95 0 bottom
R4  10K  [R0805]  7.75 61.17 90 bottom
R5  10K  [R0805]  2.46 61.17 270 bottom
R6  10K  [R0805]  4.95 71.07 0 bottom
R7  10K  [R0805]  8 36.78 90 bottom
R8  10K  [R0805]  2.16 36.78 270 bottom
R9  10K  [R0805]  5.05 47.32 0 bottom
R10  10K  [R0805]  8.31 13.67 90 bottom
R11  10K  [R0805]  2.16 13.67 270 bottom
R12  10K  [R0805]  5.13 24.46 0 bottom
U1  -  [12handian]  9.17 0.59 180 top
U2  -  [12handian]  9.17 0.59 180 bottom

## Footprints (pads in the part's own frame, mm; a bottom-side part is the same pattern mirrored in y, then rotated)
12handian
  oval 0.7x1.6 smd: 1(0,0) 2(1.4,0) 3(2.8,0) 4(4.2,0) 5(5.6,0) 6(7,0) 7(8.4,0)
LED-ARRAY-SMD_4P-L1.6-W1.5-BR_XL-1615RGBC-RF
  rect 0.8x0.65 smd: 1(0.75,-0.425) 2(0.75,0.425) 3(-0.75,0.425) 4(-0.75,-0.425)
R0805
  rect 1.133x1.377 smd: 1(-1,0) 2(1,0)

## Nets
As in the schematic.

## Via types
v1: diameter 0.61, hole 0.305, Top Layer to Bottom Layer, 55 vias

## Routing (per net, layer and track width the routed paths; a pad name or vN(x,y) marks a point on that pad's centre or on a via; arc(x,y) is an arc through that point)
LED1: length 83.9
  Top Layer w0.254: v1(9.14,81.49) 9.17,81.46 U1.1
  Bottom Layer w0.254: v1(9.14,81.49) 8,82.63 R1.1
LED2: length 96.8
  Top Layer w0.254: v1(7.77,95.08) 8.43,94.42 8.43,2.41 7.77,1.76 U1.2
  Bottom Layer w0.254: R3.2 6.21,95.08 v1(7.77,95.08)
LED3: length 88.4
  Top Layer w0.254: U1.3 6.37,1.88 7.62,3.13 7.62,82.78 v1(6.37,84.03)
  Bottom Layer w0.254: R2.2 2.48,84.03 v1(6.37,84.03)
LED4: length 63.7
  Top Layer w0.254: v1(5.46,60.02) 5.46,58.88 2.92,56.34 2.92,4.02 4.97,1.97 U1.4
  Bottom Layer w0.254: v1(5.46,60.02) 7.6,60.02 R4.1
LED5: length 73.6
  Top Layer w0.254: U1.5 3.57,2.22 2.16,3.64 2.16,56.85 2.76,57.45 2.76,67.46 v1(3.57,68.28)
  Bottom Layer w0.254: R6.2 5.95,69.92 6.15,69.73 6.15,69.47 5.97,69.3 4.59,69.3 v1(3.57,68.28)
LED6: length 60.6
  Top Layer w0.254: U1.6 2.17,1.84 1.14,2.87 1.14,56.96 v1(2.17,57.99)
  Bottom Layer w0.254: v1(2.17,57.99) 2.17,59.88 R5.2
LED7: length 35.8
  Bottom Layer w0.254: R7.1 8,34.5 9.17,33.33 9.17,15.45 9.27,15.35 9.27,11.99 9.17,11.89 U2.1
LED8: length 50.4
  Bottom Layer w0.254: R9.2 6.05,45.24 5.21,44.4 5.21,30.94 2.54,28.27 2.54,18.62 5.72,15.45 5.72,8.08 7.75,6.05 7.75,0.61 U2.2
LED9: length 37.4
  Bottom Layer w0.254: R8.2 1.78,35.4 1.78,18.5 4.7,15.57 4.7,8.08 6.6,6.18 6.6,0.82 U2.3
LED10: length 14.4
  Top Layer w0.254: v1(4.83,5.8) 6.48,7.45 v1(6.48,9.73)
  Bottom Layer w0.254: U2.4 4.83,0.74 v1(4.83,5.8) ; v1(6.48,9.73) 6.48,12.27 6.87,12.67 R10.1
LED11: length 24.9
  Top Layer w0.254: v1(3.81,6.68) 5.21,8.08 v1(5.21,17.73)
  Bottom Layer w0.254: U2.5 3.81,0.83 v1(3.81,6.68) ; v1(5.21,17.73) 6.13,18.66 R12.2
LED12: length 12.5
  Bottom Layer w0.254: U2.6 2.17,2.73 1.65,3.26 1.65,10.88 2.16,11.38 R11.2
LEDC: length 78.3
  Top Layer w0.254: v1(0.77,2.11) U1.7 ; LED1.2 6.81,90.93 7.49,90.25 7.49,88.22 6.6,87.33 6.6,85.3 5.52,84.22 5.52,66.23 LED2.2 6.55,65.92 6.99,65.49 6.99,44.27 LED3.2 6.62,43.12 6.99,42.75 6.99,21.85 LED4.2
  Bottom Layer w0.254: U1.7 v1(0.77,2.11)
  vias: v1(1.02,81.11) v1(1.02,79.96) v1(1.75,92.09) v1(1.75,90.95) v1(2.07,81.11) v1(2.09,79.96) v1(2.38,75.2) v1(2.38,74.06) v1(2.8,92.09) v1(2.82,90.95) v1(3.44,75.2) v1(3.46,74.06) v1(3.81,11.32) v1(3.81,10.18) v1(3.94,78.5) v1(3.94,77.36) v1(4.04,34.05) v1(4.04,32.91) v1(4.54,52.98) v1(4.54,51.83) v1(5.05,29.35) v1(5.05,28.21) v1(5.59,52.98) v1(5.62,51.83) v1(5.72,4.72) v1(5.72,3.57) v1(6.1,29.35) v1(6.12,28.21) v1(6.73,79.39) v1(6.73,78.25) v1(7.24,93.23) v1(7.24,92.09)
$1N1578: length 3.8
  Top Layer w0.254: v1(4.19,22.31) 4.19,20.83 LED4.3
  Bottom Layer w0.254: v1(4.19,22.31) 4.19,24.4 R12.1
$1N1583: length 7.3
  Top Layer w0.254: LED4.4 3.94,19.45 v1(3.94,14.56)
  Bottom Layer w0.254: R11.1 3.83,14.67 v1(3.94,14.56)
$1N1615: length 4.3
  Top Layer w0.254: v1(4.06,45.29) 4.06,43.38 LED3.3
  Bottom Layer w0.254: R9.1 4.06,47.31 v1(4.06,45.29)
$1N1623: length 6.8
  Top Layer w0.254: LED3.4 4.32,42.26 v1(4.32,37.67)
  Bottom Layer w0.254: R8.1 4.21,37.78 v1(4.32,37.67)
$1N1625: length 7.5
  Top Layer w0.254: v1(6.34,14.56) 6.34,19.33 LED4.1
  Bottom Layer w0.254: v1(6.34,14.56) 8.19,14.56 R10.2
$1N1643: length 6.6
  Top Layer w0.254: LED3.1 5.97,42.13 v1(5.97,37.8)
  Bottom Layer w0.254: R7.2 7.99,37.8 v1(5.97,37.8)
$1N1663: length 5.5
  Top Layer w0.254: LED2.3 4.33,68.9 v1(3.68,69.55)
  Bottom Layer w0.254: v1(3.68,69.55) 3.95,69.82 R6.1
$1N1668: length 4.8
  Top Layer w0.254: LED2.4 4.32,65.06 v1(4.32,62.17)
  Bottom Layer w0.254: R5.1 v1(4.32,62.17)
$1N1673: length 4.9
  Top Layer w0.254: LED2.1 5.97,64.93 v1(5.97,62.06)
  Bottom Layer w0.254: R4.2 7.64,62.06 v1(5.97,62.06)
$1N1675: length 4.1
  Top Layer w0.254: v1(4.08,92.92) 4.08,91.18 LED1.3
  Bottom Layer w0.254: R3.1 v1(4.08,92.92)
$1N1683: length 6.1
  Top Layer w0.254: v1(4.32,85.93) 4.33,85.94 LED1.4
  Bottom Layer w0.254: v1(4.32,85.93) 4.21,86.04 R2.1
$1N1688: length 6.5
  Top Layer w0.254: LED1.1 v1(5.83,85.81)
  Bottom Layer w0.254: v1(5.83,85.81) 7.76,85.81 R1.2

## Copper pours and planes (outline as drawn; the poured copper is in the pictures)
LEDC on Top Layer: -10.16,106.25 21.08,106.25 21.08,-2.59 -10.16,-2.59
LEDC on Bottom Layer: -15.62,111.08 26.54,111.08 26.54,-16.05 -15.62,-16.05

Small or netless copper shapes (teardrops, artwork), in the pictures only: 47 on Top Layer, 54 on Bottom Layer
